# EAGLE schematic design (EAGLE 6.1)
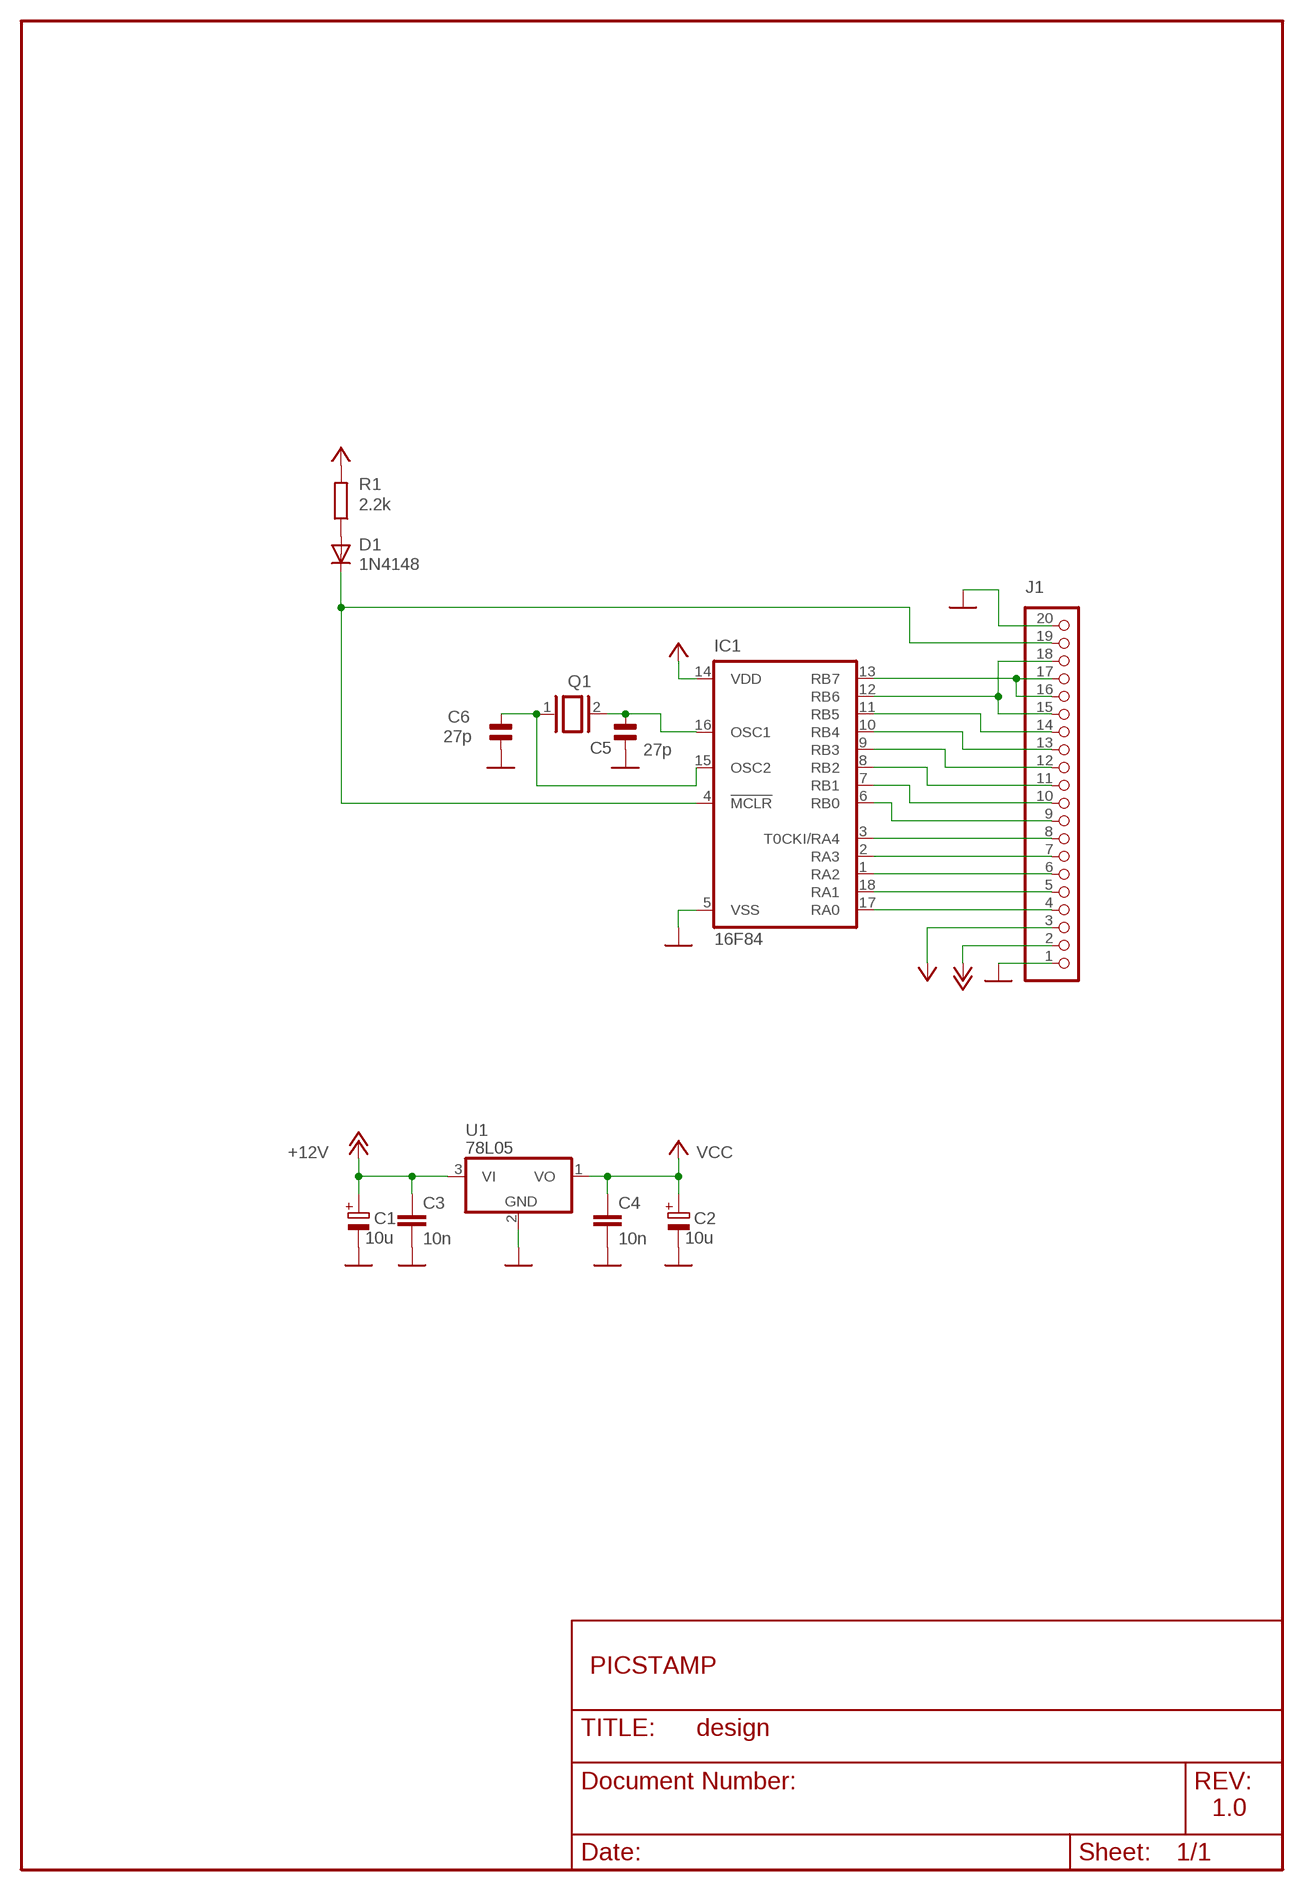
[diagram p0: schematic, sheet 1]

## Parts
C1  10u  E2,5-6  [E2,5-6]
C2  10u  E2,5-6  [E2,5-6]
C3  10n  C-EU025-025X050  [C025-025X050]
C4  10n  C-EU025-025X050  [C025-025X050]
C5  27p  C2.5/2  [C2,5-2]
C6  27p  C2.5/2  [C2,5-2]
D1  1N4148  [DO35-10]
IC1  16F84  PIC16F84AP  [DIL18]
J1  PINHD-1X20  [1X20]
Q1  XTAL/S  [QS]
R1  2.2k  R-EU_0207/10  [0207/10]
U1  78L05  78LXXZ  [TO92]

## Nets
+12V: C1.+ C3.2 J1.2 U1.3(VI)
A0: IC1.17(RA0) J1.4
A1: IC1.18(RA1) J1.5
A2: IC1.1(RA2) J1.6
A3: IC1.2(RA3) J1.7
A4: IC1.3(T0CKI/RA4) J1.8
B0: IC1.6(RB0) J1.9
B1: IC1.7(RB1) J1.10
B2: IC1.8(RB2) J1.11
B3: IC1.9(RB3) J1.12
B4: IC1.10(RB4) J1.13
B5: IC1.11(RB5) J1.14
B6: IC1.12(RB6) J1.15 J1.18
B7: IC1.13(RB7) J1.16 J1.17
GND: C1.- C2.- C3.1 C4.1 C5.1 C6.1 IC1.5(VSS) J1.1 J1.20 U1.2(GND)
N$1: D1.K(C) IC1.4(!MCLR) J1.19
N$2: D1.A R1.1
N$3: C5.2 IC1.16(OSC1) Q1.2
N$4: C6.2 IC1.15(OSC2) Q1.1
VCC: C2.+ C4.2 IC1.14(VDD) J1.3 R1.2 U1.1(VO)

## Notes on the sheet
- PICSTAMP
- 1.0

## Library data of the parts
C1 C2 = polcap:E2,5-6; DATASHEET: https://example.com/ds/cap-10u.pdf; MPN: CAP-10U-25V-ELEC
C3 C4 = rcl:C-EU: Capacitor EUrop Symbol; DATASHEET: https://example.com/ds/cap-10n.pdf; MPN: CAP-10N-50V-X7R
C5 = capacitor-wima:C: Capacitor Grid / Package width; DATASHEET: https://example.com/ds/cap-27p.pdf; MPN: CAP-27P-50V-C0G
C6 = capacitor-wima:C: Capacitor Grid / Package width; DATASHEET: https://example.com/ds/cap-27p.pdf; DNP: yes; MPN: CAP-27P-50V-C0G
D1 = diode:1N4148?: Diode High-speed diodes (Philips); DATASHEET: https://example.com/ds/1n4148.pdf; MPN: 1N4148W-TP
IC1 = microchip:PIC16F8*: Microcontroller 8-Bit PIC16F8X Family - CMOS Flash/EEPROM Pin Compatible : PIC16F83, PIC16CR83, PIC16F84A, PIC16CR84 see also PIC16C*; DATASHEET: https://example.com/ds/pic16f84a.pdf; MPN: PIC16F84A-04/P
J1 = PINHEAD:PINHD-1X20; DATASHEET: https://example.com/ds/pinhd-1x20.pdf; MPN: CONN-PINHD-1X20
Q1 = special:XTAL/S: Quarz; DATASHEET: https://example.com/ds/xtal-4mhz.pdf; DNP: yes; MPN: XTAL-4MHZ
R1 = rcl:R-EU_: Resistor EUrop Symbol; DATASHEET: https://example.com/ds/res-2k2.pdf; MPN: RES-2K2-0207
U1 = linear:78LXXZ: V-Reg. positiv voltage regulator / low power TO92; DATASHEET: https://example.com/ds/78l05.pdf; MPN: 78L05-ACZ